# EAGLE design pcb_tcc_v2 (EAGLE 9.6.2)
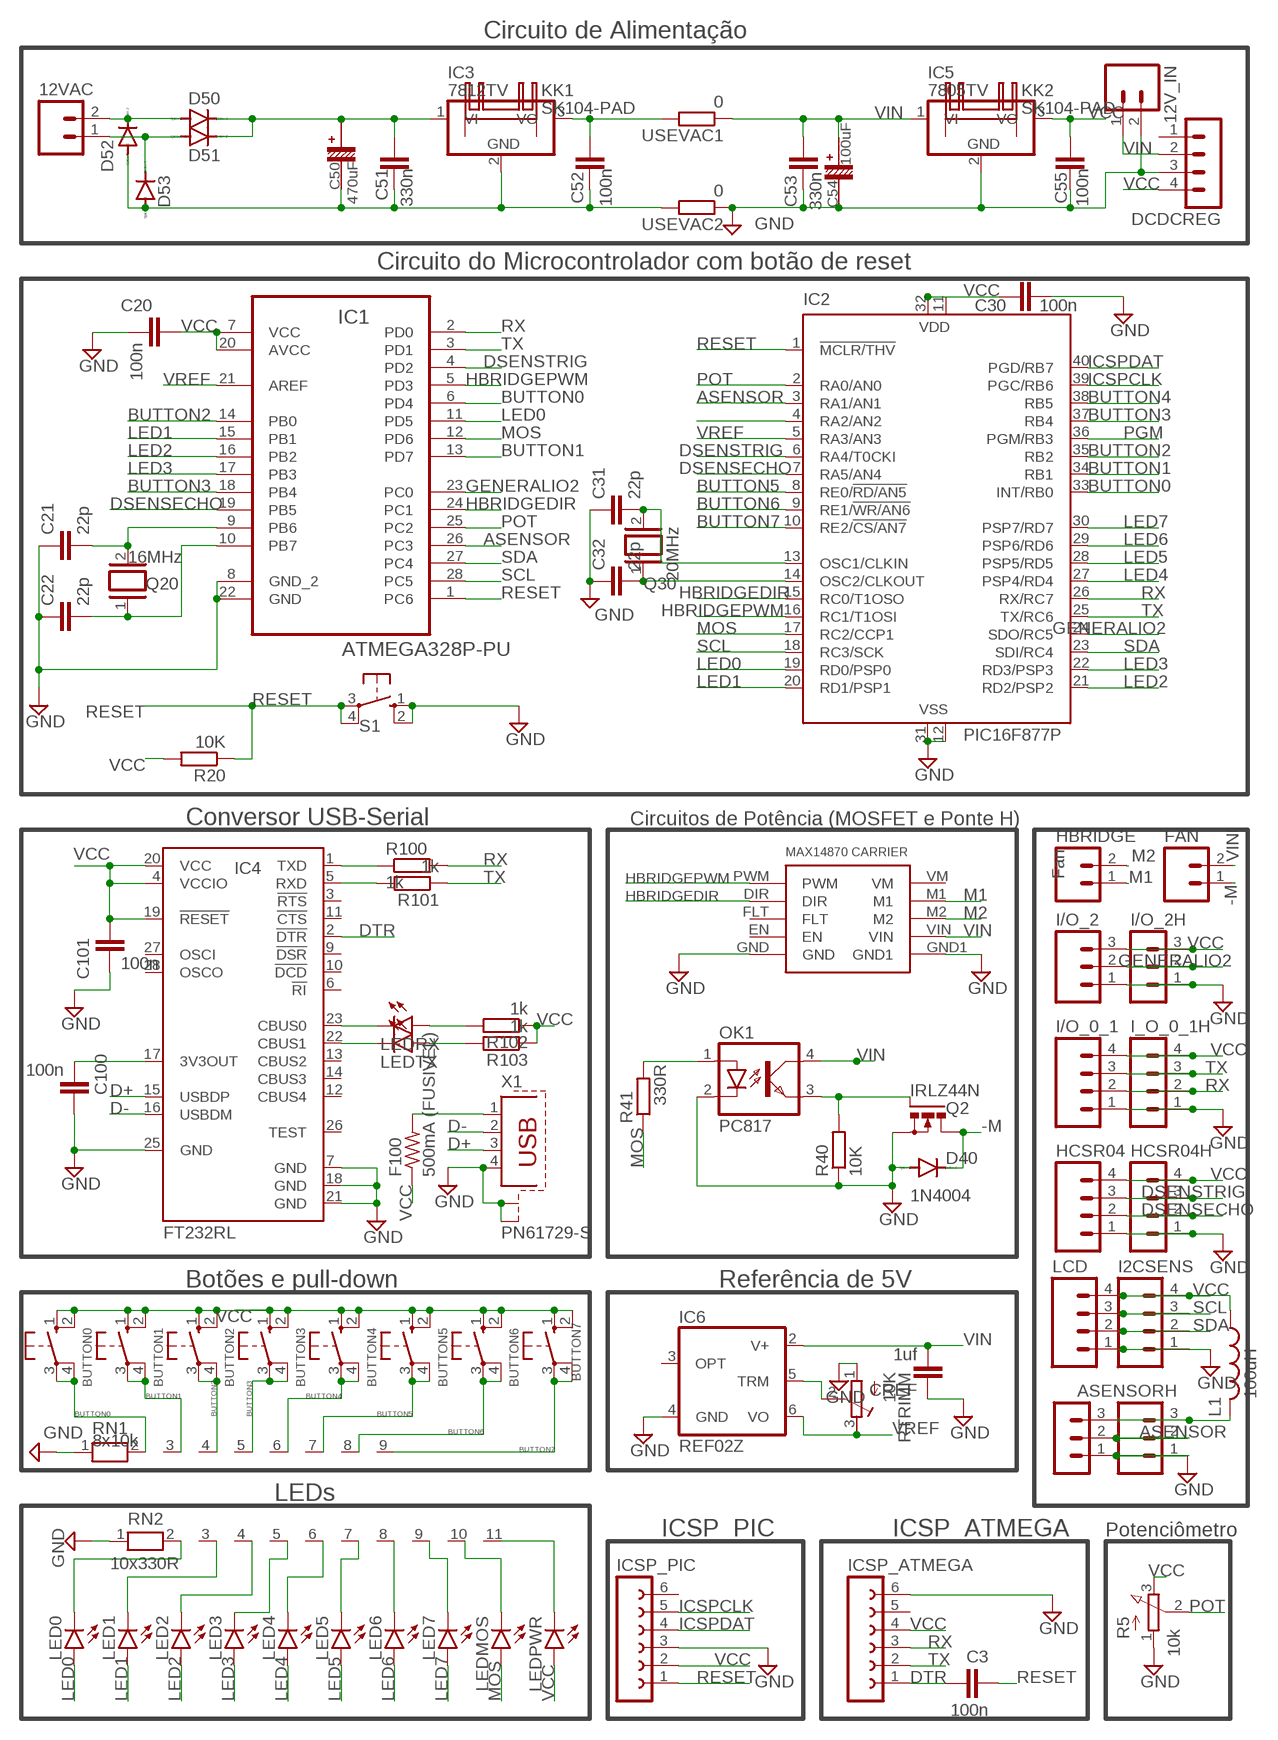
[diagram p0: schematic, sheet 1]

## Parts
12V_IN  M02  [02P]
12VAC  M02  [02P]
ASENSOR  M03  [03P]
ASENSORH  MA03-1  [MA03-1]
BUTTON0  10-XX  [B3F-10XX]
BUTTON1  10-XX  [B3F-10XX]
BUTTON2  10-XX  [B3F-10XX]
BUTTON3  10-XX  [B3F-10XX]
BUTTON4  10-XX  [B3F-10XX]
BUTTON5  10-XX  [B3F-10XX]
BUTTON6  10-XX  [B3F-10XX]
BUTTON7  10-XX  [B3F-10XX]
C3  100n  C5/2.5  [C5B2.5]
C20  100n  C5/2.5  [C5B2.5]
C21  22p  C5/2.5  [C5B2.5]
C22  22p  C5/2.5  [C5B2.5]
C30  100n  C5/2.5  [C5B2.5]
C31  22p  C5/2.5  [C5B2.5]
C32  22p  C5/2.5  [C5B2.5]
C50  470uF  CE-16V-10-5.08  [16V-10-5.08]
C51  330n  C5/2.5  [C5B2.5]
C52  100n  C5/2.5  [C5B2.5]
C53  330n  C5/2.5  [C5B2.5]
C54  100uF  CE-16V-06.3-2.54  [16V-6.3-2.54]
C55  100n  C5/2.5  [C5B2.5]
C100  100n  C5/2.5  [C5B2.5]
C101  100n  C5/2.5  [C5B2.5]
CREF  1uf  C2.5/2  [C2.5-2]
D40  1N4004  [DO41-10]
D50  1N4004  [DO41-10]
D51  1N4004  [DO41-10]
D52  1N4004  [DO41-10]
D53  1N4004  [DO41-10]
DCDCREG  MA04-1  [MA04-1]
F100  500mA (FUSIVEL)  R-US_R1206  [R1206]
FAN  M02  [02P]
HBRIDGE  M02  [02P]
HCSR04  M04  [04P]
HCSR04H  MA04-1  [MA04-1]
I2CSENS  M04  [04P]
I/O_0_1  M04  [04P]
I/O_2  M03  [03P]
I/O_2H  MA03-1  [MA03-1]
I_O_0_1H  MA04-1  [MA04-1]
IC1  ATMEGA328P-PU  [DIP254P762X457-28]
IC2  PIC16F877P  [DIL40]
IC3  7812TV  [TO220V]
IC4  FT232RL  [SSOP28]
IC5  7805TV  [TO220V]
IC6  REF02Z  [DIL08]
ICSP_ATMEGA  FE06-1  [FE06]
ICSP_PIC  FE06-1  [FE06]
KK1  SK104-PAD  [SK104-PAD]
KK2  SK104-PAD  [SK104-PAD]
L1  100uH  L-US0204/7  [0204/7]
LCD  M04  [04P]
LED0  LED3MM  [LED3MM]
LED1  LED3MM  [LED3MM]
LED2  LED3MM  [LED3MM]
LED3  LED3MM  [LED3MM]
LED4  LED3MM  [LED3MM]
LED5  LED3MM  [LED3MM]
LED6  LED3MM  [LED3MM]
LED7  LED3MM  [LED3MM]
LEDMOS  LED3MM  [LED3MM]
LEDPWR  LED3MM  [LED3MM]
LEDRX  LED3MM  [LED3MM]
LEDTX  LED3MM  [LED3MM]
OK1  PC817  [DIL04]
Q2  IRLZ44N  IRF512  [TO220BV]
Q20  16MHz  XTAL/S  [QS]
Q30  20MHz  XTAL/S  [QS]
R5  10k  3RP/1610N  [3RP/1610N]
R20  10K  R-EU_0207/10  [0207/10]
R40  10K  R-EU_0207/10  [0207/10]
R41  330R  R-EU_0207/7  [0207/7]
R100  1k  R-EU_0207/10  [0207/10]
R101  1k  R-EU_0207/10  [0207/10]
R102  1k  R-EU_0207/10  [0207/10]
R103  1k  R-EU_0207/10  [0207/10]
RN1  8x10k  RN08  [RN-9]
RN2  10x330R  RN10  [RN-11]
RTRIMM  10K  R-TRIMM3296W  [RTRIM3296W]
S1  10-XX  [B3F-10XX]
U$1  MAX14870  [POLOLU_CARRIER]
USEVAC1  0  R-EU_0207/10  [0207/10]
USEVAC2  0  R-EU_0207/10  [0207/10]
X1  PN61729-S  [PN61729-S]

## Nets
-M: D40.C FAN.1 Q2.D
ASENSOR: ASENSOR.2 ASENSORH.2 IC1.26(PC3) IC2.3(RA1/AN1)
BUTTON0: BUTTON0.3(P) BUTTON0.4(P1) IC1.6(PD4) IC2.33(INT/RB0) RN1.2
BUTTON1: BUTTON1.3(P) BUTTON1.4(P1) IC1.13(PD7) IC2.34(RB1) RN1.3
BUTTON2: BUTTON2.3(P) BUTTON2.4(P1) IC1.14(PB0) IC2.35(RB2) RN1.4
BUTTON3: BUTTON3.3(P) BUTTON3.4(P1) IC1.18(PB4) IC2.37(RB4) RN1.5
BUTTON4: BUTTON4.3(P) BUTTON4.4(P1) IC2.38(RB5) RN1.6
BUTTON5: BUTTON5.3(P) BUTTON5.4(P1) IC2.8(RE0/!RD/AN5) RN1.7
BUTTON6: BUTTON6.3(P) BUTTON6.4(P1) IC2.9(RE1/!WR/AN6) RN1.8
BUTTON7: BUTTON7.3(P) BUTTON7.4(P1) IC2.10(RE2/!CS/AN7) RN1.9
D+: IC4.15(USBDP) X1.3
D-: IC4.16(USBDM) X1.2
DSENSECHO: HCSR04.2 HCSR04H.2 IC1.19(PB5) IC2.7(RA5/AN4)
DSENSTRIG: HCSR04.3 HCSR04H.3 IC1.4(PD2) IC2.6(RA4/T0CKI)
DTR: C3.1 IC4.2(!DTR) ICSP_ATMEGA.1
GENERALIO2: I/O_2.2 I/O_2H.2 IC1.23(PC0) IC2.24(SDO/RC5)
GND: 12V_IN.2 ASENSOR.1 ASENSORH.1 C20.2 C21.1 C22.1 C30.2 C31.1 C32.1 C53.1 C54.- C55.1 C100.1 C101.2 CREF.1 D40.A DCDCREG.3 HCSR04.1 HCSR04H.1 I2CSENS.1 I/O_0_1.1 I/O_2.1 I/O_2H.1 I_O_0_1H.1 IC1.8(GND_2) IC1.22(GND) IC2.12(VSS) IC2.31(VSS) IC4.7(GND) IC4.18(GND) IC4.21(GND) IC4.25(GND) IC5.2(GND) IC6.4(GND) ICSP_ATMEGA.6 ICSP_PIC.3 LCD.1 OK1.2(C) Q2.S R5.1(A) R40.1 RN1.1 RN2.1 RTRIMM.1(A) S1.1(S) S1.2(S1) U$1.GND U$1.GND1 USEVAC2.1 X1.4 X1.S1 X1.S2
HBRIDGEDIR: IC1.24(PC1) IC2.15(RC0/T1OSO) U$1.DIR
HBRIDGEPWM: IC1.5(PD3) IC2.16(RC1/T1OSI) U$1.PWM
ICSPCLK: IC2.39(PGC/RB6) ICSP_PIC.5
ICSPDAT: IC2.40(PGD/RB7) ICSP_PIC.4
LED0: IC1.11(PD5) IC2.19(RD0/PSP0) LED0.A
LED1: IC1.15(PB1) IC2.20(RD1/PSP1) LED1.A
LED2: IC1.16(PB2) IC2.21(RD2/PSP2) LED2.A
LED3: IC1.17(PB3) IC2.22(RD3/PSP3) LED3.A
LED4: IC2.27(PSP4/RD4) LED4.A
LED5: IC2.28(PSP5/RD5) LED5.A
LED6: IC2.29(PSP6/RD6) LED6.A
LED7: IC2.30(PSP7/RD7) LED7.A
M1: HBRIDGE.1 U$1.M1
M2: HBRIDGE.2 U$1.M2
MOS: IC1.12(PD6) IC2.17(RC2/CCP1) LEDMOS.A R41.1
N$1: C21.2 IC1.9(PB6) Q20.2
N$2: C22.2 IC1.10(PB7) Q20.1
N$3: 12VAC.2 D50.A D52.C
N$4: OK1.3(EMIT) Q2.G R40.2
N$5: 12VAC.1 D51.A D53.C
N$6: ASENSOR.3 ASENSORH.3 L1.2
N$7: C50.- C51.1 C52.1 D52.A D53.A IC3.2(GND) USEVAC2.2
N$8: OK1.1(A) R41.2
N$9: C50.+ C51.2 D50.C D51.C IC3.1(VI)
N$10: LED0.K(C) RN2.2
N$11: C100.2 IC4.17(3V3OUT)
N$12: IC2.4(RA2/AN2)
N$13: IC4.1(TXD) R100.1
N$14: IC4.5(RXD) R101.2
N$15: C52.2 IC3.3(VO) USEVAC1.2
N$16: LED1.K(C) RN2.3
N$17: LED2.K(C) RN2.4
N$18: LED3.K(C) RN2.5
N$19: LED4.K(C) RN2.6
N$20: LED5.K(C) RN2.7
N$21: C31.2 IC2.13(OSC1/CLKIN) Q30.2
N$22: C32.2 IC2.14(OSC2/CLKOUT) Q30.1
N$23: LED6.K(C) RN2.8
N$24: LED7.K(C) RN2.9
N$25: LEDMOS.K(C) RN2.10
N$26: IC6.5(TRM) RTRIMM.2(S)
N$27: LEDPWR.K(C) RN2.11
N$28: F100.2 X1.1
N$29: IC4.23(CBUS0) LEDRX.K(C)
N$30: IC4.22(CBUS1) LEDTX.K(C)
N$31: LEDRX.A R102.2
N$32: LEDTX.A R103.2
PGM: IC2.36(PGM/RB3)
POT: IC1.25(PC2) IC2.2(RA0/AN0) R5.2(S)
RESET: C3.2 IC1.1(PC6) IC2.1(!MCLR/THV) ICSP_PIC.1 R20.1 S1.3(P) S1.4(P1)
RX: I/O_0_1.2 I_O_0_1H.2 IC1.2(PD0) IC2.26(RX/RC7) ICSP_ATMEGA.3 R100.2
SCL: I2CSENS.3 IC1.28(PC5) IC2.18(RC3/SCK) LCD.3
SDA: I2CSENS.2 IC1.27(PC4) IC2.23(SDI/RC4) LCD.2
TX: I/O_0_1.3 I_O_0_1H.3 IC1.3(PD1) IC2.25(TX/RC6) ICSP_ATMEGA.2 R101.1
VCC: BUTTON0.1(S) BUTTON0.2(S1) BUTTON1.1(S) BUTTON1.2(S1) BUTTON2.1(S) BUTTON2.2(S1) BUTTON3.1(S) BUTTON3.2(S1) BUTTON4.1(S) BUTTON4.2(S1) BUTTON5.1(S) BUTTON5.2(S1) BUTTON6.1(S) BUTTON6.2(S1) BUTTON7.1(S) BUTTON7.2(S1) C20.1 C30.1 C55.2 C101.1 DCDCREG.4 F100.1 HCSR04.4 HCSR04H.4 I2CSENS.4 I/O_0_1.4 I/O_2.3 I/O_2H.3 I_O_0_1H.4 IC1.7(VCC) IC1.20(AVCC) IC2.11(VDD) IC2.32(VDD) IC4.4(VCCIO) IC4.19(!RESET) IC4.20(VCC) IC5.3(VO) ICSP_ATMEGA.4 ICSP_PIC.2 L1.1 LCD.4 LEDPWR.A R5.3(E) R20.2 R102.1 R103.1
VIN: 12V_IN.1 C53.2 C54.+ CREF.2 DCDCREG.2 FAN.2 IC5.1(VI) IC6.2(V+) OK1.4(COL) U$1.VIN USEVAC1.1
VREF: IC1.21(AREF) IC2.5(RA3/AN3) IC6.6(VO) RTRIMM.3(E)
Unconnected: DCDCREG.1 IC4.3(!RTS) IC4.6(!RI) IC4.9(!DSR) IC4.10(!DCD) IC4.11(!CTS) IC4.12(CBUS4) IC4.13(CBUS2) IC4.14(CBUS3) IC4.26(TEST) IC4.27(OSCI) IC4.28(OSCO) IC6.3(OPT) ICSP_ATMEGA.5 ICSP_PIC.6 KK1.K1(K) KK1.K2(K) KK2.K1(K) KK2.K2(K) U$1.EN U$1.FLT U$1.VM

## Notes on the sheet
- Circuito de Alimentação
- Circuito do Microcontrolador com botão de reset
- Conversor USB-Serial | Circuitos de Potência (MOSFET e Ponte H)
- Fan
- Botões e pull-down | Referência de 5V
- LEDs
- ICSP_PIC | ICSP_ATMEGA | Potenciômetro

## Library data of the parts
12V_IN 12VAC FAN HBRIDGE = con-amp-quick:M02: AMP QUICK CONNECTOR; OC_FARNELL: unknown; OC_NEWARK: unknown
ASENSOR I/O_2 = con-amp-quick:M03: AMP QUICK CONNECTOR; OC_FARNELL: unknown; OC_NEWARK: unknown
ASENSORH I/O_2H = con-lstb:MA03-1: PIN HEADER; OC_FARNELL: unknown; OC_NEWARK: unknown
BUTTON0 BUTTON1-BUTTON7 S1 = switch-omron:10-XX: OMRON SWITCH; MPN: B3F-1000; OC_FARNELL: 176432; OC_NEWARK: 36M3542
C3 C20-C22 C30-C32 C51-C53 C55 C100 C101 CREF = capacitor-wima:C: CAPACITOR naming: grid - package width
C50 C54 = a_caps:CE-: ELECTROLYTIC CAPACITOR Japanese symbol
D40 D50-D53 = diode:1N4004: DIODE general purpose rectifier, 1 A
DCDCREG HCSR04H I_O_0_1H = con-lstb:MA04-1: PIN HEADER; OC_FARNELL: unknown; OC_NEWARK: unknown
F100 = rcl:R-US_: RESISTOR, American symbol; SPICEPREFIX: R
HCSR04 I2CSENS I/O_0_1 LCD = con-amp-quick:M04: AMP QUICK CONNECTOR; OC_FARNELL: unknown; OC_NEWARK: unknown
IC1 = Atmel_By_element14_Batch_1-00:ATMEGA328P-PU: 8-bit Microcontroller with In-System Programmable Flash; MPN: ATMEGA328P-PU; OC_FARNELL: 1715487; OC_NEWARK: 15R0268; PACKAGE: PDIP-28; SUPPLIER: Atmel
IC2 = microchip:PIC16F87*: MICROCONTROLLER; MF: MICROCHIP; MPN: PIC16F877-04/P; OC_FARNELL: 9761349; OC_NEWARK: 61K3463
IC3 IC5 = linear:78*: Positive VOLTAGE REGULATOR Source: http://cache.national.com/ds/LM/LM78L05.pdf http://www.fairchildsemi.com/ds/LM/LM7805.pdf
IC4 = ftdichip:FT232R: Source: http://www.ftdichip.com/Documents/DataSheets/DS_FT232R_v104.pdf; MPN: FT232RL; OC_FARNELL: 1146032; OC_NEWARK: 91K9918
IC6 = linear:REF02: VOLTAGE REFERENCE
ICSP_ATMEGA ICSP_PIC = con-lsta:FE06-1: FEMALE HEADER; OC_FARNELL: unknown; OC_NEWARK: unknown
KK1 KK2 = heatsink:SK104-PAD: HEATSINK manufacturer Fischer/distributor Buerklin
L1 = rcl:L-US: INDUCTOR, American symbol; SPICEPREFIX: L
LED0 LED1-LED7 LEDMOS LEDPWR LEDRX LEDTX = led:LED: LED OSRAM: - CHIPLED LG R971, LG N971, LY N971, LG Q971, LY Q971, LO R971, LY R971 LH N974, LH R974 LS Q976, LO Q976, LY Q976 LO Q996 - Hyper CHIPLED LW Q18S LB Q993, LB Q99A, LB R99A - SideLED LS A670, LO A670, LY A670, LG A670, LP A670 LB A673, LV A673, LT A673, LW A673 LH A674 LY A675 LS A676, LA A676, LO A676, LY A676, LW A676 LS A679, LY A679, LG A679 - Hyper Micro SIDELED® LS Y876, LA Y876, LO Y876, LY Y876 LT Y87S - SmartLED LW L88C, LW L88S LB L89C, LB L89S, LG L890 LS L89K, LO L89K, LY L89K LS L896, LA L896, LO L896, LY L896 - TOPLED LS T670, LO T670, LY T670, LG T670, LP T670 LSG T670, LSP T670, LSY T670, LOP T670, LYG T670 LG T671, LOG T671, LSG T671 LB T673, LV T673, LT T673, LW T673 LH T674 LS T676, LA T676, LO T676, LY T676, LB T676, LH T676, LSB T676, LW T676 LB T67C, LV T67C, LT T67C, LS T67K, LO T67K, LY T67K, LW E67C LS E67B, LA E67B, LO E67B, LY E67B, LB E67C, LV E67C, LT E67C LW T67C LS T679, LY T679, LG T679 LS T770, LO T770, LY T770, LG T770, LP T770 LB T773, LV T773, LT T773, LW T773 LH T774 LS E675, LA E675, LY E675, LS T675 LS T776, LA T776, LO T776, LY T776, LB T776 LHGB T686 LT T68C, LB T68C - Hyper Mini TOPLED® LB M676 - Mini TOPLED Santana® LG M470 LS M47K, LO M47K, LY M47K Source: http://www.osram.convergy.de LUXEON: - LUMILED® LXK2-PW12-R00, LXK2-PW12-S00, LXK2-PW14-U00, LXK2-PW14-V00 LXK2-PM12-R00, LXK2-PM12-S00, LXK2-PM14-U00 LXK2-PE12-Q00, LXK2-PE12-R00, LXK2-PE12-S00, LXK2-PE14-T00, LXK2-PE14-U00 LXK2-PB12-K00, LXK2-PB12-L00, LXK2-PB12-M00, LXK2-PB14-N00, LXK2-PB14-P00, LXK2-PB14-Q00 LXK2-PR12-L00, LXK2-PR12-M00, LXK2-PR14-Q00, LXK2-PR14-R00 LXK2-PD12-Q00, LXK2-PD12-R00, LXK2-PD12-S00 LXK2-PH12-R00, LXK2-PH12-S00 LXK2-PL12-P00, LXK2-PL12-Q00, LXK2-PL12-R00 Source: www.luxeon.com KINGBRIGHT: KA-3528ASYC Source: www.kingbright.com
OK1 = optocoupler:PC817: SHARP OPTO COUPLER; MPN: PC817X4J000F; OC_FARNELL: 9707727; OC_NEWARK: 97K7059
Q2 = transistor-power:IRF512: N-CHANNEL MOS FET
Q20 Q30 = special:XTAL/S: CRYSTAL
R5 = pot:3RP/1610N: 16mm Potentiometer one level Source: http://www.alphapotentiometers.net/html/16mm_pot_2.html
R20 R40 R41 R100-R103 USEVAC1 USEVAC2 = rcl:R-EU_: RESISTOR, European symbol; SPICEPREFIX: R
RN1 = resistor-net:RN08: RESISTOR NETWORK; OC_FARNELL: unknown; OC_NEWARK: unknown
RN2 = resistor-net:RN10: RESISTOR NETWORK; OC_FARNELL: unknown; OC_NEWARK: unknown
RTRIMM = resistor:R-TRIMM: Trimm resistor
U$1 = luciano:MAX14870
X1 = con-berg:PN61729-S: BERG USB connector; OC_FARNELL: unknown; OC_NEWARK: unknown

## Board
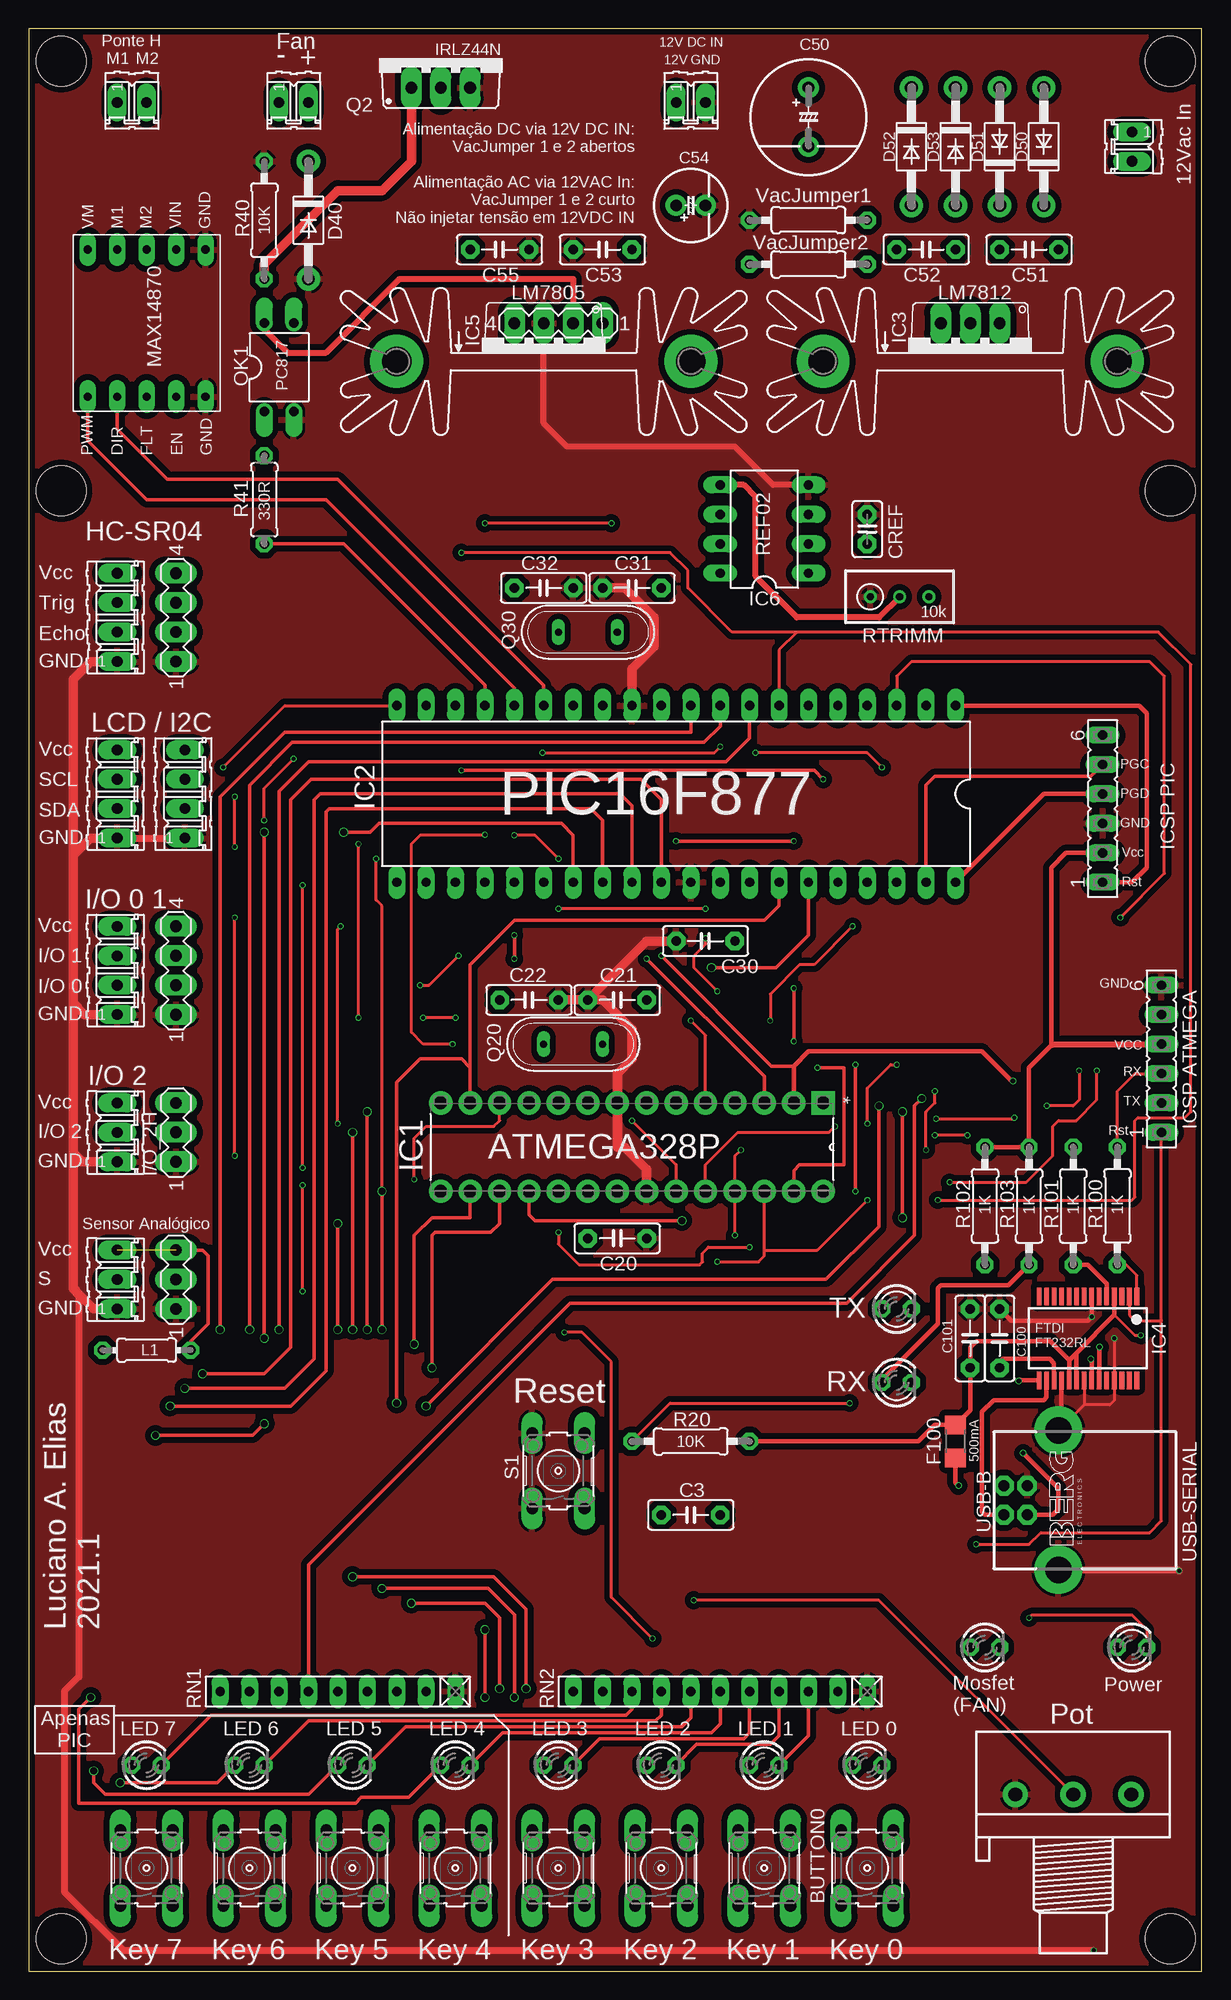
[diagram p1: board, top side]
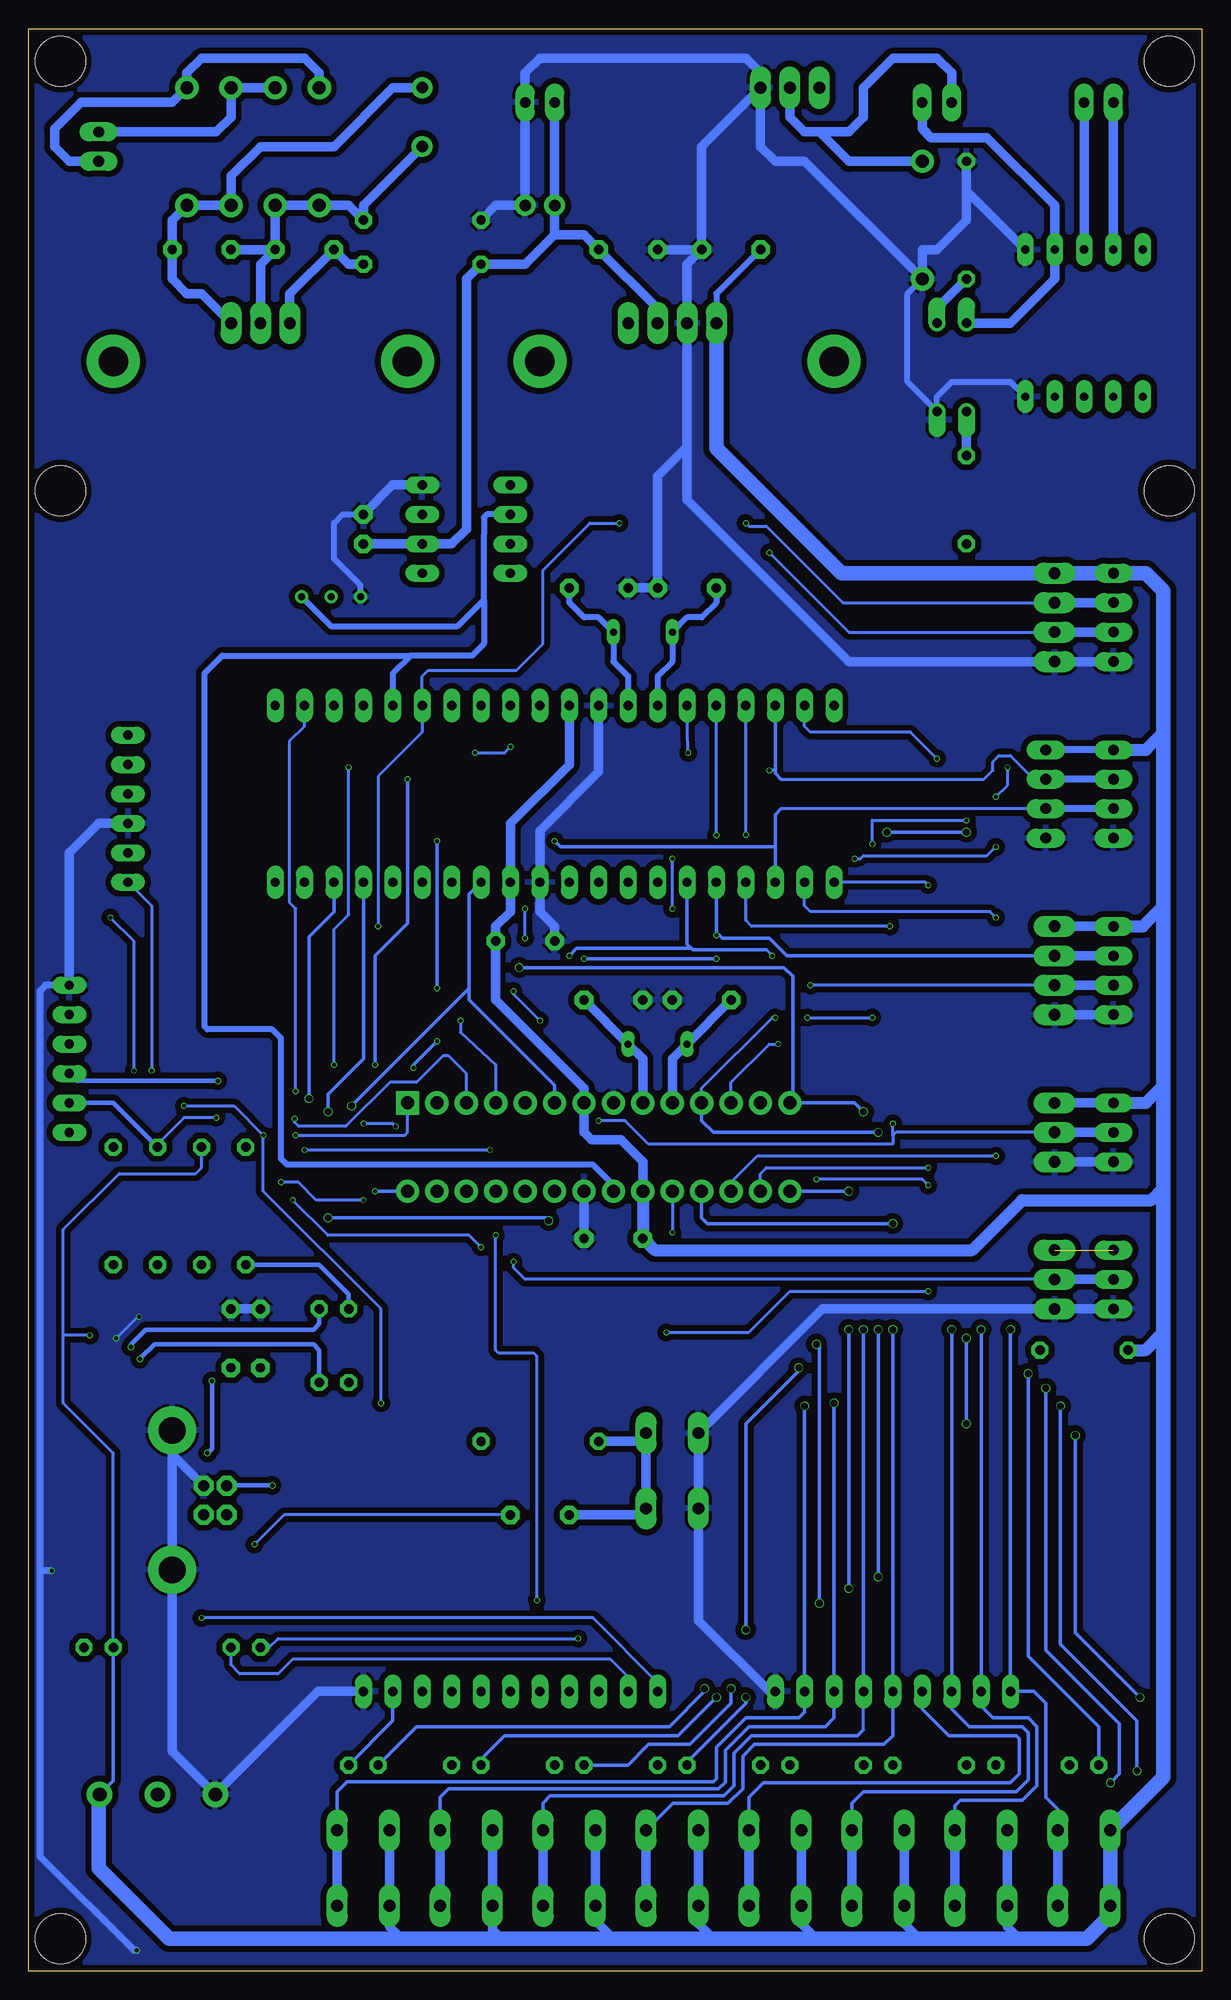
[diagram p2: board, bottom side, seen from below]

Size 101.27 x 167.63 mm. Coordinates in mm from the lower left corner, seen from the top.
Outline: 0,0 101.27,0 101.27,167.63 0,167.63 0,0
Copper layers (1*16): Top 0.035mm / dielectric 1.6mm / Bottom 0.035mm
Design rules "jlcpcb-2layers": minimum track width 5mil, minimum drill 0.3mm, track to track 5mil, track to pad 5mil, pad to pad 5mil, via to via 5mil, smd to smd 5mil, copper to edge 0.2mm, drill to drill 6mil, minimum pad ring 10mil, minimum via ring 3mil, stop-mask expansion 4mil, vias tented up to drill 0mil, thermal gap 10mil
Holes 4.32 mm at 2.79,164.85 98.55,164.85 98.55,2.79 2.79,2.79 2.79,127.76 98.55,127.76

### Footprints (pad centres in the part's own frame; a part is rotated, then mirrored left to right if it is on the bottom)
02P = drill 0.914 long: 1 -1.27,0; 2 1.27,0
03P = drill 0.914 long: 1 -2.54,0; 2 0,0; 3 2.54,0
MA03-1 = drill 1.016 long: 1 -2.54,0; 2 0,0; 3 2.54,0
B3F-10XX = drill 1.016 long: 1 -3.251,2.261; 2 3.251,2.261; 3 -3.251,-2.261; 4 3.251,-2.261
C5B2.5 = drill 0.813 pad 1.6 octagon: 1 -2.54,0; 2 2.54,0
16V-10-5.08 = drill 1: + -2.54,0; - 2.54,0
16V-6.3-2.54 = drill 1: + -1.27,0; - 1.27,0
C2.5-2 = drill 0.813 pad 1.6 octagon: 1 -1.27,0; 2 1.27,0
DO41-10 = drill 1.118: A 5.08,0; C -5.08,0
MA04-1 = drill 1.016 long: 1 -3.81,0; 2 -1.27,0; 3 1.27,0; 4 3.81,0
R1206 = smd 1.6 x 1.803: 1 -1.422,0; 2 1.422,0
04P = drill 0.914 long: 1 -3.81,0; 2 -1.27,0; 3 1.27,0; 4 3.81,0
DIP254P762X457-28 = drill 1.118 square: 1 -7.62,33.02 | drill 1.118: 2 -7.62,30.48; 3 -7.62,27.94; 4 -7.62,25.4; 5 -7.62,22.86; 6 -7.62,20.32; 7 -7.62,17.78; 8 -7.62,15.24; 9 -7.62,12.7; 10 -7.62,10.16; 11 -7.62,7.62; 12 -7.62,5.08; 13 -7.62,2.54; 14 -7.62,0; 15 0,0; 16 0,2.54; 17 0,5.08; 18 0,7.62; 19 0,10.16; 20 0,12.7; 21 0,15.24; 22 0,17.78; 23 0,20.32; 24 0,22.86; 25 0,25.4; 26 0,27.94; 27 0,30.48; 28 0,33.02
DIL40 = drill 0.813 long: 1 -24.13,-7.62; 2 -21.59,-7.62; 3 -19.05,-7.62; 4 -16.51,-7.62; 5 -13.97,-7.62; 6 -11.43,-7.62; 7 -8.89,-7.62; 8 -6.35,-7.62; 9 -3.81,-7.62; 10 -1.27,-7.62; 11 1.27,-7.62; 12 3.81,-7.62; 13 6.35,-7.62; 14 8.89,-7.62; 15 11.43,-7.62; 16 13.97,-7.62; 17 16.51,-7.62; 18 19.05,-7.62; 19 21.59,-7.62; 20 24.13,-7.62; 21 24.13,7.62; 22 21.59,7.62; 23 19.05,7.62; 24 16.51,7.62; 25 13.97,7.62; 26 11.43,7.62; 27 8.89,7.62; 28 6.35,7.62; 29 3.81,7.62; 30 1.27,7.62; 31 -1.27,7.62; 32 -3.81,7.62; 33 -6.35,7.62; 34 -8.89,7.62; 35 -11.43,7.62; 36 -13.97,7.62; 37 -16.51,7.62; 38 -19.05,7.62; 39 -21.59,7.62; 40 -24.13,7.62
TO220V = drill 1.016 long: 1 -2.54,-2.54; 2 0,-2.54; 3 2.54,-2.54
SSOP28 = smd 0.4 x 1.5: 1 -4.225,-3.625; 2 -3.575,-3.625; 3 -2.925,-3.625; 4 -2.275,-3.625; 5 -1.625,-3.625; 6 -0.975,-3.625; 7 -0.325,-3.625; 8 0.325,-3.625; 9 0.975,-3.625; 10 1.625,-3.625; 11 2.275,-3.625; 12 2.925,-3.625; 13 3.575,-3.625; 14 4.225,-3.625; 15 4.225,3.625; 16 3.575,3.625; 17 2.925,3.625; 18 2.275,3.625; 19 1.625,3.625; 20 0.975,3.625; 21 0.325,3.625; 22 -0.325,3.625; 23 -0.975,3.625; 24 -1.625,3.625; 25 -2.275,3.625; 26 -2.925,3.625; 27 -3.575,3.625; 28 -4.225,3.625
DIL08 = drill 0.813 long: 1 -3.81,-3.81; 2 -1.27,-3.81; 3 1.27,-3.81; 4 3.81,-3.81; 5 3.81,3.81; 6 1.27,3.81; 7 -1.27,3.81; 8 -3.81,3.81
FE06 = drill 0.813 long: 1 -6.35,0; 2 -3.81,0; 3 -1.27,0; 4 1.27,0; 5 3.81,0; 6 6.35,0
SK104-PAD = drill 2.54 pad 3.81: K1 -12.7,-0.762; K2 12.7,-0.762
0204/7 = drill 0.813 octagon: 1 -3.81,0; 2 3.81,0
LED3MM = drill 0.813 octagon: A -1.27,0; K 1.27,0
DIL04 = drill 0.813 offset: 1 -1.27,-3.81; 2 1.27,-3.81; 3 1.27,3.81; 4 -1.27,3.81
TO220BV = drill 1.016 long: D 0,-2.54; G -2.54,-2.54; S 2.54,-2.54
QS = drill 0.61 long: 1 -2.54,0; 2 2.54,0
3RP/1610N = drill 1.2 pad 2.184: 1 -5,0; 2 0,0; 3 5,0
0207/10 = drill 0.813 octagon: 1 -5.08,0; 2 5.08,0
0207/7 = drill 0.813 octagon: 1 -3.81,0; 2 3.81,0
RN-9 = drill 0.813 long: 1 -10.16,0; 2 -7.62,0; 3 -5.08,0; 4 -2.54,0; 5 0,0; 6 2.54,0; 7 5.08,0; 8 7.62,0; 9 10.16,0
RN-11 = drill 0.813 long: 1 -12.7,0; 2 -10.16,0; 3 -7.62,0; 4 -5.08,0; 5 -2.54,0; 6 0,0; 7 2.54,0; 8 5.08,0; 9 7.62,0; 10 10.16,0; 11 12.7,0
RTRIM3296W = drill 0.61: 1 0,-2.54; 2 0,0; 3 0,2.54
POLOLU_CARRIER = drill 0.7 pad 1.422 long: DIR -5.08,0; EN -5.08,-5.08; FLT -5.08,-2.54; GND -5.08,-7.62; GND1 7.62,-7.62; M1 7.62,0; M2 7.62,-2.54; PWM -5.08,2.54; VIN 7.62,-5.08; VM 7.62,2.54
PN61729-S = drill 0.95 octagon: 1 1.25,4.71; 2 -1.25,4.71; 3 -1.25,2.71; 4 1.25,2.71 | drill 2.3 pad 2.9: S1 -6.02,0; S2 6.02,0

### Placement (x,y rotation side)
12V_IN  57.15,161.29 0 top
12VAC  95.25,157.48 270 top
ASENSOR  7.62,59.69 90 top
ASENSORH  12.7,59.69 90 top
BUTTON0  72.39,8.89 90 top
BUTTON1  63.5,8.89 90 top
BUTTON2  54.61,8.89 90 top
BUTTON3  45.72,8.89 90 top
BUTTON4  36.83,8.89 90 top
BUTTON5  27.94,8.89 90 top
BUTTON6  19.05,8.89 90 top
BUTTON7  10.16,8.89 90 top
C3  57.15,39.37 180 top
C20  50.8,63.25 0 top
C21  50.8,83.82 0 top
C22  43.18,83.82 180 top
C30  58.42,88.9 180 top
C31  52.07,119.38 0 top
C32  44.45,119.38 180 top
C50  67.31,160.02 270 top
C51  86.36,148.59 0 top
C52  77.47,148.59 180 top
C53  49.53,148.59 0 top
C54  57.15,152.4 0 top
C55  40.64,148.59 180 top
C100  83.82,54.61 270 top
C101  81.28,54.61 90 top
CREF  72.39,124.46 270 top
D40  24.13,151.13 270 top
D50  87.63,157.48 90 top
D51  83.82,157.48 90 top
D52  76.2,157.48 270 top
D53  80.01,157.48 270 top
DCDCREG  45.72,142.24 180 top
F100  80.01,45.72 270 top
FAN  22.86,161.29 0 top
HBRIDGE  8.89,161.29 0 top
HCSR04  7.62,116.84 90 top
HCSR04H  12.7,116.84 90 top
I2CSENS  7.62,101.6 90 top
I/O_0_1  7.62,86.36 90 top
I/O_2  7.62,72.39 90 top
I/O_2H  12.7,72.39 90 top
I_O_0_1H  12.7,86.36 90 top
IC1  35.56,67.31 270 top
IC2  55.88,101.6 180 top
IC3  81.28,139.7 180 top
IC4  91.44,54.61 180 top
IC5  44.45,139.7 180 top
IC6  63.5,124.46 90 top
ICSP_ATMEGA  97.79,78.74 90 top
ICSP_PIC  92.71,100.33 90 top
KK1  81.28,139.7 0 top
KK2  44.45,139.7 0 top
L1  10.16,53.59 0 top
LCD  13.46,101.6 90 top
LED0  72.39,17.78 0 top
LED1  63.5,17.78 0 top
LED2  54.61,17.78 0 top
LED3  45.72,17.78 0 top
LED4  36.83,17.78 0 top
LED5  27.94,17.78 0 top
LED6  19.05,17.78 0 top
LED7  10.16,17.78 0 top
LEDMOS  82.55,27.94 0 top
LEDPWR  95.25,27.94 0 top
LEDRX  74.93,57.15 0 top
LEDTX  74.93,50.8 0 top
OK1  21.59,138.43 0 top
Q2  35.56,165.1 0 top
Q20  46.99,80.01 0 top
Q30  48.26,115.57 0 top
R5  90.17,15.24 0 top
R20  57.15,45.72 0 top
R40  20.32,151.13 270 top
R41  20.32,127 90 top
R100  93.98,66.04 90 top
R101  90.17,66.04 270 top
R102  82.55,66.04 270 top
R103  86.36,66.04 270 top
RN1  26.67,24.13 180 top
RN2  59.69,24.13 180 top
RTRIMM  75.18,118.62 270 top
S1  45.72,43.18 90 top
U$1  7.62,140.97 90 top
USEVAC1  67.31,147.32 0 top
USEVAC2  67.31,151.13 0 top
X1  88.9,40.64 90 top

### Tracks (layer width: path | path; a pad name or v marks a point on that pad's centre or on a via)
-M
  Bottom 0.813: FAN.1 21.59,163.83 22.86,165.1 26.67,165.1 29.21,162.56 29.21,160.02 30.48,158.75 33.02,158.75 | 33.02,158.75 30.48,156.21 D40.C | 33.02,158.75 34.29,158.75 35.56,160.02 Q2.D
ASENSOR  (via drill 0.35)
  Top 0.254: v59.44,61.21 62.99,61.21 63.5,61.72 63.5,62.23 | 63.5,62.23 IC1.26 | 63.5,62.23 68.07,62.23 v72.39,66.55 | v79.5,68.07 86.11,68.07 88.39,70.36 88.39,72.9 88.9,73.41 90.42,73.41 92.2,75.18 v92.2,77.72 | v94.23,90.93 98.04,94.74 98.04,111.76 96.77,113.03 76.2,113.03 74.93,111.76 IC2.3
  Bottom 0.254: ASENSORH.2 58.42,59.69 59.44,60.71 v59.44,61.21 | v72.39,66.55 76.45,66.55 77.98,68.07 v79.5,68.07 | v92.2,77.72 92.2,88.9 v94.23,90.93
  Bottom 0.813: ASENSOR.2 ASENSORH.2
BUTTON0  (via drill 0.6)
  Top 0.305: v34.29,48.77 45.21,59.69 68.83,59.69 73.41,64.26 v73.41,74.68
  Top 0.61: BUTTON0.3 74.65,7.14
  Bottom 0.305: BUTTON0.4 74.65,14.71 74.68,14.73 74.68,15.49 73.81,16.36 42.16,16.36 41.91,16.61 41.91,19.3 39.37,21.84 34.8,21.84 34.29,22.35 RN1.2 v34.29,48.77 | v73.41,74.68 63.25,84.84 | IC2.33 63.25,92.96 63.25,84.84 | IC1.6 55.88,76.45 63.25,83.82 63.25,84.84
  Bottom 0.813: BUTTON0.4 BUTTON0.3
BUTTON1  (via drill 0.6)
  Top 0.305: v31.75,49.02 31.75,76.71 33.78,78.74 37.34,78.74 38.1,77.98 IC1.13 38.1,86.87 41.91,90.68 63.5,90.68 64.77,91.95 IC2.34
  Bottom 0.305: BUTTON1.4 65.76,15.01 65.05,15.72 41.73,15.72 41.15,16.31 41.15,19.05 39.12,21.08 32.51,21.08 31.75,21.84 RN1.3 v31.75,49.02
  Bottom 0.813: BUTTON1.4 BUTTON1.3
BUTTON2  (via drill 0.6)
  Top 0.305: v29.21,55.37 v29.21,74.17 | v58.93,86.61 64.52,86.61 67.31,89.41 IC2.35
  Bottom 0.254: 29.21,20.83 RN1.4
  Bottom 0.305: BUTTON2.4 56.87,14.5 56.26,15.11 41.28,15.11 40.39,16 40.39,18.8 38.86,20.32 29.72,20.32 29.21,20.83 | RN1.4 v29.21,55.37 | v29.21,74.17 29.97,74.93 IC1.14 35.31,75.18 35.31,85.85 36.07,86.61 v58.93,86.61
  Bottom 0.813: BUTTON2.4 BUTTON2.3
BUTTON3  (via drill 0.6)
  Top 0.305: v26.67,55.37 v26.67,64.52 | v75.44,74.17 v75.44,65.02 | v56.39,64.77 43.69,64.77 43.18,65.28 IC1.18
  Bottom 0.305: BUTTON3.4 45.64,14.48 40.89,14.48 39.62,15.75 39.62,18.54 38.61,19.56 27.43,19.56 26.67,20.32 RN1.5 v26.67,55.37 | v26.67,64.52 42.67,64.52 43.18,65.02 IC1.18 | IC2.37 72.39,78.74 75.44,75.69 v75.44,74.17 | v75.44,65.02 56.64,65.02 v56.39,64.77
  Bottom 0.813: BUTTON3.4 BUTTON3.3
BUTTON4  (via drill 0.6)
  Top 0.305: RN1.6 24.13,35.05 46.74,57.66 70.61,57.66 76.45,63.5 76.45,74.68 v77.09,75.31
  Bottom 0.305: BUTTON4.4 39.09,15.01 37.85,16.26 16.51,16.26 15.75,17.02 15.75,20.07 16,20.32 21.84,20.32 24.13,22.61 RN1.6 | v77.09,75.31 77.09,89.28 74.93,91.44 IC2.38
  Bottom 0.813: BUTTON4.4 BUTTON4.3
BUTTON5  (via drill 0.6)
  Top 0.305: v21.59,55.37 21.59,101.85 24.13,104.39 60.2,104.39 62.23,106.43 IC2.8
  Bottom 0.305: BUTTON5.4 30.2,14.5 29.21,15.49 16,15.49 14.99,16.51 14.99,20.57 15.49,21.08 20.07,21.08 21.59,22.61 RN1.7 v21.59,55.37
  Bottom 0.813: BUTTON5.4 BUTTON5.3
BUTTON6  (via drill 0.6)
  Top 0.305: v19.05,55.37 19.05,102.36 22.73,106.05 58.29,106.05 59.69,107.44 IC2.9
  Bottom 0.305: BUTTON6.4 21.31,14.25 20.83,14.73 15.49,14.73 14.22,16 14.22,21.08 14.99,21.84 18.03,21.84 19.05,22.86 RN1.8 v19.05,55.37
  Bottom 0.813: BUTTON6.4 BUTTON6.3
BUTTON7  (via drill 0.6)
  Top 0.305: v16.51,55.37 16.51,101.35 22.1,106.93 57.15,106.93 IC2.10
  Bottom 0.305: BUTTON7.4 12.42,13.95 13.46,14.99 13.46,23.11 14.48,24.13 RN1.9 v16.51,55.37
  Bottom 0.813: BUTTON7.4 BUTTON7.3
D+  (via drill 0.4)
  Top 0.406: IC4.15 85.67,50.98 85.6,51.05 v85.47,50.93 | v85.85,44.7 88.9,41.66 88.9,39.88 88.41,39.39 X1.3
  Bottom 0.406: v85.47,50.93 85.47,45.09 v85.85,44.7
D-
  Top 0.406: IC4.16 87.86,49.51 87.63,49.28 83.31,49.28 82.3,48.26 82.3,39.62 82.53,39.39 X1.2
DSENSECHO  (via drill 0.35)
  Top 0.254: v45.72,63.75 45.72,62.74 47.5,60.96 57.91,60.96 58.17,61.21 58.17,61.98 58.67,62.48 v62.23,62.48 | v78.49,66.55 95.25,66.55 95.5,66.8 95.5,73.41 95.76,73.66 99.82,73.66 100.33,74.17 100.33,112.78 97.54,115.57 66.29,115.57 | 66.29,115.57 64.77,114.05 IC2.7 | 66.29,115.57 60.71,115.57 56.9,119.38 56.9,120.9 55.37,122.43 v37.34,122.43
  Bottom 0.254: IC1.19 v45.72,63.75 | v62.23,62.48 63.25,63.5 75.44,63.5 v78.49,66.55 | v37.34,122.43 30.48,115.57 HCSR04H.2
  Bottom 0.813: HCSR04.2 HCSR04H.2
DSENSTRIG  (via drill 0.35)
  Top 0.254: v71.12,90.17 67.82,86.87 66.55,86.87 64.01,84.33 v64.01,82.04 | v50.29,124.97 v39.37,124.97 | HCSR04H.3 12.19,118.11 11.94,118.36 12.45,118.36 HCSR04H.3
  Bottom 0.254: v71.12,90.17 71.12,103.12 67.31,106.93 IC2.6 67.31,111.76 66.8,112.27 59.18,112.27 56.9,114.55 56.9,120.9 52.83,124.97 v50.29,124.97 | v64.01,82.04 64.01,81.03 60.96,78.23 IC1.4 | v39.37,124.97 39.12,124.71 37.59,124.71 30.99,118.11 HCSR04H.3
  Bottom 0.813: HCSR04.3 HCSR04H.3
DTR  (via drill 0.35)
  Top 0.254: v81.79,36.83 86.36,36.83 87.38,37.85 96.77,37.85 97.79,38.86 97.79,56.13 | 97.79,56.13 ICSP_ATMEGA.1 | IC4.2 95.02,56.62 95.5,56.13 97.79,56.13
  Bottom 0.254: C3.1 79.25,39.37 v81.79,36.83
GENERALIO2  (via drill 0.35)
  Top 0.254: v52.07,73.41 55.88,69.6 IC1.23 | v26.67,73.15 26.67,89.92 v26.92,90.17
  Bottom 0.254: I/O_2H.2 26.42,72.39 26.67,72.14 | 26.67,72.14 26.67,71.37 47.75,71.37 49.78,73.41 v52.07,73.41 | 26.67,72.14 v26.67,73.15 | v26.92,90.17 38.86,90.17 39.37,90.68 IC2.24
  Bottom 0.813: I/O_2.2 I/O_2H.2
GND  (via drill 0.35)
  Top 0.254: IC4.25 | IC4.25 93.73,49.28 93.33,48.88 91.11,48.88 | IC4.21 91.11,48.88 | 91.11,48.88 89.16,46.92 | v93.73,54.61 IC4.25
  Top 0.406: IC4.18 89.16,46.92 X1.S2 | IC4.7 v91.77,56.46 91.44,56.13 84.84,56.13 C100.1
  Top 0.508: IC6.4 64.26,128.27 60.96,131.57 46.48,131.57 44.45,133.6 DCDCREG.3
  Top 0.61: X1.S1 99.24,34.62 v99.31,34.54 | 4.32,58.42 4.32,25.4 3.05,24.13 3.05,6.86 8.13,1.78 v91.95,1.78 | I2CSENS.1 LCD.1
  Top 0.813: IC1.22 53.34,69.22 51.44,71.12 50.8,71.12 IC1.8 50.8,77.47 52.07,78.74 52.07,81.28 49.53,83.82 C21.1 | C22.1 C21.1 | C21.1 53.34,88.9 C30.2 | IC2.12 52.07,112.39 53.98,114.3 53.98,116.84 51.44,119.38 C31.1 | ASENSOR.1 5.59,57.15 4.32,58.42 3.81,58.93 3.81,70.61 | HCSR04.1 5.33,113.03 3.81,111.51 3.81,96.27 | 3.81,70.61 3.81,83.57 | 3.81,83.57 3.81,96.27 | I2CSENS.1 5.33,97.79 3.81,96.27 | I/O_0_1.1 4.83,82.55 3.81,83.57 | I/O_2.1 4.57,69.85 3.81,70.61
  Bottom 0.254: v91.77,56.46 91.88,56.46 v93.73,54.61
  Bottom 0.508: D40.A 25.4,144.78 25.4,137.16 OK1.2 22.86,135.89 21.59,137.16 16.51,137.16 U$1.GND | RTRIMM.1 72.64,119.63 74.93,121.92 74.93,124.97 74.17,125.73 CREF.1
  Bottom 0.61: ICSP_ATMEGA.6 99.82,85.09 100.33,84.58 100.33,34.8 | v91.95,1.78 92.2,1.78 100.33,9.91 100.33,34.8 | v99.31,34.54 100.08,34.54 100.33,34.8
  Bottom 0.813: USEVAC2.1 60.96,152.4 C54.- 12V_IN.2 58.42,163.83 57.15,165.1 39.37,165.1 38.1,163.83 Q2.S | Q2.S 43.18,157.48 C55.1 | C55.1 C53.1 | C55.1 44.45,147.32 DCDCREG.3 44.45,131.57 | U$1.GND1 20.32,153.67 R40.1 20.32,151.13 22.86,148.59 24.13,148.59 D40.A 34.29,156.21 36.83,156.21 38.1,157.48 Q2.S | CREF.1 69.85,128.27 IC6.4 | HCSR04.1 HCSR04H.1 30.48,113.03 44.45,127 44.45,131.57 | I/O_0_1.1 I_O_0_1H.1 | I/O_2H.1 I/O_2.1 | ASENSOR.1 ASENSORH.1 32.74,57.15 S1.2 S1.1 43.46,30.25 37.34,24.13 RN1.1 | C20.2 IC1.22 | C30.2 55.88,90.17 57.15,91.44 IC2.31 57.15,98.42 52.07,103.5 IC2.12 | RN2.1 76.28,24.13 R5.1 88.9,18.97 X1.S1 88.9,46.35 89.53,46.99 89.23,46.99 X1.S2 88.9,44.6 X1.4 | C100.1 C101.2 | ICSP_ATMEGA.6 97.79,96.52 95.25,99.06 ICSP_PIC.3 | C31.1 C32.1 46.99,129.03 44.45,131.57
  pour Bottom (isolate 0.508): 0.25,167.39 101.09,167.39 101.09,0.25 0.25,0.25
  pour Top (isolate 0.508): 0.25,167.39 101.09,167.39 101.09,0.25 0.25,0.25
HBRIDGEDIR  (via drill 0.35)
  Top 0.254: IC1.24 58.42,69.6 61.21,72.39 69.09,72.39 v69.6,72.9 | v72.39,73.15 72.39,76.2 74.42,78.23 v74.93,78.23 | v73.66,103.89 72.39,105.16 v62.74,105.16 | v44.35,105.16 44.45,105.13 59.16,105.13 v59.69,105.66
  Top 0.305: IC2.15 44.45,111 26.67,128.78 11.94,128.78 7.62,133.1 U$1.DIR
  Bottom 0.254: v69.6,72.9 69.85,73.15 v72.39,73.15 | v74.93,78.23 74.93,89.92 73.66,91.19 v73.66,103.89 | v62.74,105.16 60.2,105.16 v59.69,105.66 | v44.35,105.16 IC2.15
HBRIDGEPWM  (via drill 0.35)
  Top 0.254: IC1.5 58.42,80.77 v57.15,82.04 | v59.44,84.58 57.4,86.61 57.4,87.63 58.42,88.65 v58.42,89.15 | v58.42,91.69 v45.72,91.69 | v45.72,96.01 43.69,98.04 v41.91,98.04
  Top 0.305: IC2.16 41.91,110.74 25.65,127 10.16,127 5.08,132.08 U$1.PWM
  Bottom 0.254: v57.15,82.04 59.44,84.33 v59.44,84.58 | v58.42,89.15 v58.42,91.69 | v45.72,91.69 v45.72,96.01 | v41.91,98.04 IC2.16
ICSPCLK
  Top 0.305: ICSP_PIC.5 91.69,103.12 78.23,103.12 77.47,102.36 IC2.39
ICSPDAT
  Top 0.406: ICSP_PIC.4 87.63,101.6 IC2.40
LED0  (via drill 0.35, 0.6)
  Top 0.254: v36.83,82.3 v34.04,82.3 | v28.45,82.3 v28.45,97.28 | v20.32,99.31 20.32,102.11 v22.86,104.65
  Top 0.305: v42.93,24.38 42.93,31.24 40.13,34.04 v27.94,34.04 | v27.94,55.37 v27.94,72.39
  Bottom 0.254: IC1.11 43.18,76.2 37.08,82.3 v36.83,82.3 | v34.04,82.3 v28.45,82.3 | v28.45,97.28 28.45,99.34 20.32,99.34 v20.32,99.31 | v22.86,104.65 25.15,106.93 33.78,106.93 34.29,107.44 IC2.19
  Bottom 0.305: LED0.A 67.82,21.08 45.97,21.08 42.93,24.13 v42.93,24.38 | v27.94,34.04 v27.94,55.37 | v27.94,72.39 42.16,72.39 43.18,73.41 IC1.11
LED1  (via drill 0.35, 0.6)
  Top 0.254: v30.48,67.31 30.48,91.95 29.97,92.46 v29.97,96.01 | v17.78,97.03 v17.78,101.35 | v16.76,103.89 22.1,109.22 IC2.20
  Top 0.305: v30.48,67.31 v30.48,55.37 | v30.48,33.02 39.62,33.02 41.91,30.73 v41.91,23.62
  Bottom 0.254: v29.97,96.01 29.46,96.01 29.21,96.27 18.54,96.27 v17.78,97.03 | v17.78,101.35 16.76,102.36 v16.76,103.89
  Bottom 0.305: IC1.15 v30.48,67.31 | v30.48,55.37 v30.48,33.02 | v41.91,23.62 45.21,20.32 60.2,20.32 62.23,18.29 LED1.A
LED2  (via drill 0.35, 0.6)
  Top 0.254: v23.62,69.34 v23.62,93.73
  Top 0.305: v40.64,24.38 40.64,30.48 39.37,31.75 v33.02,31.75 | v33.27,54.1 33.27,63.5 34.8,65.02 38.1,65.02 IC1.16
  Bottom 0.254: IC1.16 38.1,68.83 37.59,69.34 v23.62,69.34 | v23.62,93.73 23.88,93.98 IC2.21
  Bottom 0.305: LED2.A 49.53,17.78 47.75,19.56 44.2,19.56 40.64,23.11 v40.64,24.38 | v33.02,31.75 33.02,53.85 v33.27,54.1
LED3  (via drill 0.35, 0.6)
  Top 0.254: v17.78,70.36 v17.78,90.93
  Top 0.305: v39.37,23.62 v39.37,29.46 | v34.8,52.07 34.8,63.5 35.05,63.75 39.88,63.75 40.64,64.52 IC1.17
  Bottom 0.254: IC1.17 40.64,68.07 38.35,70.36 v17.78,70.36 | v17.78,90.93 18.29,91.44 33.78,91.44 34.29,91.95 IC2.22
  Bottom 0.305: LED3.A 44.45,18.03 39.37,23.11 v39.37,23.62 | v39.37,29.46 39.37,47.24 34.8,51.82 v34.8,52.07
LED4  (via drill 0.6)
  Top 0.305: LED4.A 32.77,14.99 28.7,14.99 28.19,14.48 4.32,14.48 4.32,22.61 v5.33,23.62 | v10.92,46.23 19.3,46.23 v20.32,47.24 | v20.32,54.61 v20.32,98.3 | v27.18,98.3 29.46,98.3 30.23,99.06 45.97,99.06 46.99,98.04 IC2.27
  Bottom 0.305: v5.33,23.62 10.92,29.21 v10.92,46.23 | v20.32,47.24 v20.32,54.61 | v20.32,98.3 v27.18,98.3
LED5  (via drill 0.6)
  Top 0.305: LED5.A 24.13,15.24 6.6,15.24 5.59,16.26 v5.59,17.27 | v12.19,48.77 22.61,48.77 25.65,51.82 25.65,100.08 25.91,100.33 48.51,100.33 49.53,99.31 IC2.28
  Bottom 0.305: v5.59,17.27 5.59,21.59 12.19,28.19 v12.19,48.77
LED6  (via drill 0.6)
  Top 0.305: LED6.A 16.26,16.26 v7.87,16.26 | v13.46,50.29 22.1,50.29 24.64,52.83 24.64,101.09 25.15,101.6 51.05,101.6 52.07,100.58 IC2.29
  Bottom 0.305: v7.87,16.26 7.11,17.02 7.11,21.34 13.46,27.69 v13.46,50.29
LED7  (via drill 0.6)
  Top 0.305: v14.99,51.56 20.32,51.56 22.61,53.85 22.61,101.09 24.38,102.87 52.83,102.87 54.61,101.09 IC2.30
  Bottom 0.305: LED7.A 8.89,21.08 14.99,27.18 v14.99,51.56
M1
  Bottom 0.813: HBRIDGE.1 U$1.M1
M2
  Bottom 0.813: HBRIDGE.2 U$1.M2
MOS  (via drill 0.35)
  Top 0.254: v53.85,28.7 50.29,32.26 50.29,52.58 47.75,55.12 v46.23,55.12 | v23.62,58.67 v23.62,67.82 | v33.27,68.33 33.27,71.88 34.29,72.9 40.13,72.9 40.64,73.41 IC1.12 | v36.58,80.01 34.04,80.01 33.02,81.03 33.02,97.28 33.8,98.07 v39.37,98.07
  Top 0.305: IC2.17 39.37,111 27.18,123.19 R41.1
  Bottom 0.254: LEDMOS.A 80.52,27.94 79.76,28.7 v53.85,28.7 | v46.23,55.12 39.12,55.12 35.56,58.67 v23.62,58.67 | v23.62,67.82 24.13,68.33 v33.27,68.33 | IC1.12 40.64,76.71 37.34,80.01 v36.58,80.01 | v39.37,98.07 IC2.17
N$1
  Bottom 0.813: IC1.9 48.26,78.74 Q20.2 C21.2
N$2
  Bottom 0.813: IC1.10 45.72,78.74 Q20.1 C22.2
N$3
  Bottom 0.813: D52.C 76.2,163.83 77.47,165.1 86.36,165.1 87.63,163.83 D50.A 88.9,161.29 96.77,161.29 99.06,159 99.06,157.48 97.79,156.21 12VAC.2
N$4
  Top 0.813: R40.2 20.32,147.32 26.67,153.67 30.48,153.67 33.02,156.21 Q2.G
  Bottom 0.813: R40.2 22.86,143.51 OK1.3
N$5
  Bottom 0.813: 12VAC.1 85.09,158.75 83.82,160.02 D51.A D53.C
N$6  (1 unrouted)
  Top 0.305: L1.2 13.97,54.36 15.49,55.88 15.49,61.72 14.99,62.23 ASENSORH.3
N$7
  Bottom 0.813: C52.1 D53.A D52.A 73.66,152.4 USEVAC2.2 72.39,152.4 C50.- | C52.1 C51.1 | IC3.2 81.28,147.32 C52.1
N$8
  Bottom 0.813: OK1.1 R41.2
N$9
  Bottom 0.813: IC3.1 86.36,144.78 87.63,144.78 88.9,146.05 C51.2 88.9,151.13 D50.C D51.C 83.82,154.94 81.28,157.48 74.93,157.48 69.85,162.56 C50.+
N$10
  Bottom 0.305: LED0.K 69.85,21.59 RN2.2
N$11
  Top 0.406: IC4.17 88.52,52.45 88.14,52.83 84.07,52.83 83.82,52.58 C100.2
N$13
  Top 0.254: 95.66,58.84 IC4.1 95.66,60.04 94.74,60.96 R100.1
  Bottom 0.254: 94.23,61.21 R100.1
N$14
  Top 0.406: IC4.5 93.06,59.34 91.44,60.96 R101.2
N$15
  Bottom 0.813: IC3.3 78.74,144.78 C52.2 73.66,147.32 USEVAC1.2
N$16
  Top 0.305: LED1.K 67.31,20.32 RN2.3
N$17
  Top 0.305: LED2.K 57.66,19.56 64.01,19.56 64.77,20.32 RN2.4
N$18
  Top 0.305: LED3.K 49.28,20.07 61.72,20.07 62.23,20.57 RN2.5
N$19
  Top 0.305: LED4.K 40.89,20.57 58.93,20.57 59.69,21.34 RN2.6
N$20
  Top 0.305: LED5.K 32.51,21.08 56.39,21.08 57.15,21.84 RN2.7
N$21
  Bottom 0.508: C31.2 54.61,118.11 53.34,116.84 52.07,116.84 Q30.2 50.8,113.03 49.53,111.76 IC2.13
N$22
  Bottom 0.508: IC2.14 46.99,111.76 45.72,113.03 Q30.1 44.45,116.84 43.18,116.84 41.91,118.11 C32.2
N$23
  Top 0.305: LED6.K 24.13,21.59 54.1,21.59 54.61,22.1 RN2.8
N$24
  Top 0.305: LED7.K 15.75,22.1 51.56,22.1 52.07,22.61 RN2.9
N$25
  Bottom 0.254: RN2.10 49.53,25.4 51.05,26.92 78.49,26.92 79.76,25.65 83.06,25.65 83.82,26.42 LEDMOS.K
N$26
  Top 0.508: RTRIMM.2 73.41,116.84 66.29,116.84 62.74,120.4 62.74,127.25 61.72,128.27 IC6.5
N$27  (via drill 0.35)
  Top 0.254: v86.36,30.48 86.61,30.73 95.25,30.73 96.52,29.46 LEDPWR.K
  Bottom 0.254: RN2.11 46.99,24.89 52.58,30.48 v86.36,30.48
N$28  (via drill 0.4)
  Top 0.406: F100.2 80.01,42.16 v80.26,41.91
  Bottom 0.406: v80.26,41.91 84.17,41.91 X1.1
N$29  (via drill 0.4)
  Top 0.406: IC4.23 92.41,53.81 v92.46,53.85
  Bottom 0.406: v92.46,53.85 92.46,54.1 91.19,55.37 76.71,55.37 76.2,55.88 LEDRX.K
N$30  (via drill 0.4)
  Top 0.406: IC4.22 91.77,52.76 v91.69,52.83
  Bottom 0.406: v91.69,52.83 90.42,54.1 76.71,54.1 76.2,53.59 LEDTX.K
N$31
  Bottom 0.406: LEDRX.A 73.66,58.42 76.2,60.96 R102.2
N$32
  Top 0.406: LEDTX.A 73.66,51.05 78.49,55.88 78.49,58.93 78.74,59.18 84.58,59.18 R103.2
POT  (via drill 0.35)
  Top 0.254: R5.2 73.41,32 v57.4,32 | v60.96,63.5 IC1.25 60.96,70.36 v61.47,70.87 | v77.47,70.87 77.47,74.17 78.23,74.93 v78.23,75.95
  Bottom 0.254: v57.4,32 57.4,53.09 57.66,53.34 60.71,53.34 60.96,53.59 v60.96,63.5 | v61.47,70.87 v77.47,70.87 | v78.23,75.95 78.23,91.69 78.74,92.2 78.74,106.17 77.47,107.44 IC2.2
RESET  (via drill 0.35)
  Top 0.254: v90.68,77.72 90.68,75.18 90.17,74.68 v87.88,74.68 | v81.03,72.14 v78.23,72.14 | R20.1 55.37,49.02 v70.87,49.02
  Top 0.406: ICSP_PIC.1 95.25,93.98 96.52,95.25 96.52,108.58 95.88,109.22 IC2.1
  Bottom 0.254: ICSP_PIC.1 90.68,91.95 v90.68,77.72 | v87.88,74.68 83.57,74.68 v81.03,72.14 81.03,67.31 70.87,57.15 v70.87,49.02 | v78.23,72.14 68.83,72.14 68.58,72.39 IC1.1
  Bottom 0.813: R20.1 48.69,45.72 S1.4 S1.3 48.54,39.37 C3.2
RX  (via drill 0.35, 0.4)
  Top 0.254: v33.78,85.09 34.54,85.09 v37.08,87.63 | R100.2 93.98,75.95 95.5,77.47 ICSP_ATMEGA.3
  Top 0.305: v54.61,87.63 64.14,78.11 66.04,78.11
  Top 0.406: v84.96,76.83 84.84,76.83 82.3,79.38 67.31,79.38 66.04,78.11 IC1.2
  Bottom 0.254: I_O_0_1H.2 v33.78,85.09 | v37.08,87.63 37.59,88.14
  Bottom 0.305: 37.59,88.14 43.94,88.14 44.07,88.27 | 44.07,88.27 44.45,88.65 IC2.26 | 44.07,88.27 53.98,88.27 v54.61,87.63
  Bottom 0.406: ICSP_ATMEGA.3 97.16,76.83 v84.96,76.83
  Bottom 0.813: I/O_0_1.2 I_O_0_1H.2
SCL  (via drill 0.35)
  Top 0.305: v71.37,67.31 v71.37,78.23 | v68.58,102.87 67.82,103.63 v37.34,103.63
  Bottom 0.254: 36.32,102.87 18.8,102.87 18.03,103.63 18.03,104.39 17.53,104.9 16.51,104.9 14.48,102.87 LCD.3
  Bottom 0.305: 36.83,103.63 36.83,103.38 36.32,102.87 | 36.83,103.63 IC2.18 | IC1.28 v71.37,67.31 | v71.37,78.23 71.37,87.63 68.58,90.42 v68.58,102.87 | v37.34,103.63 36.83,103.63
  Bottom 0.61: I2CSENS.3 LCD.3
SDA  (via drill 0.35)
  Top 0.305: IC1.27 66.04,69.09 66.55,69.6 70.36,69.6 70.36,77.98 v68.07,77.98 | v66.04,84.84 v66.04,80.26 | v66.04,97.54 v55.88,97.54
  Bottom 0.254: LCD.2 36.32,100.33
  Bottom 0.305: 36.32,100.33 36.83,99.82 36.83,97.03 | 36.83,97.03 IC2.23 | v68.07,77.98 68.07,78.23 v66.04,80.26 | v66.04,97.54 v66.04,84.84 | v55.88,97.54 55.37,97.03 36.83,97.03
  Bottom 0.61: I2CSENS.2 LCD.2
TX  (via drill 0.35)
  Top 0.254: v78.33,73.56 84.99,73.56 v85.09,73.66
  Top 0.305: IC1.3 63.5,77.22 v53.34,87.38 | v41.91,87.38 v41.91,89.41
  Bottom 0.254: IC1.3 63.5,77.47 65.02,78.99 65.53,78.99 67.82,76.71 70.1,76.71 73.91,72.9 77.98,72.9 78.33,73.25 v78.33,73.56 | v85.09,73.66 87.88,73.66 90.3,71.25
  Bottom 0.305: I_O_0_1H.3 35.81,87.63 37.34,89.15 41.4,89.15 41.66,89.41 v41.91,89.41 IC2.25 | v53.34,87.38 v41.91,87.38
  Bottom 0.406: R101.1 90.3,71.25 93.98,74.93 ICSP_ATMEGA.2
  Bottom 0.813: I/O_0_1.3 I_O_0_1H.3
VCC  (via drill 0.35)
  Top 0.254: 93.71,56.64 95.49,54.86 v96.01,54.86
  Top 0.406: ICSP_PIC.2 89.53,96.52 88.27,95.25 88.27,80.01 88.33,79.95 86.36,77.98 R103.1 R102.1 | 93.98,80.01 ICSP_ATMEGA.4 | IC4.4 93.71,56.64 93.71,56.63 90.42,53.34 | 90.42,53.34 90.42,51.03 IC4.20 | IC4.19 89.81,52.73 | 89.81,52.73 90.42,53.34 | 89.81,52.73 88.19,54.36 81.79,54.36 81.28,53.85 C101.1 81.28,48.41 F100.1 78.23,47.14 76.81,45.72 R20.2
  Top 0.508: 88.33,79.95 88.39,80.01 ICSP_ATMEGA.4
  Bottom 0.254: LEDPWR.A 93.98,44.7 98.3,49.02 98.3,54.86 | 98.3,54.86 98.3,64.01 93.47,68.83 86.87,68.83 86.36,69.34 R103.1 | v96.01,54.86 98.3,54.86
  Bottom 0.305: LEDPWR.A 93.98,16.43 95.25,15.16
  Bottom 0.508: C55.2 41.91,144.78 DCDCREG.4
  Bottom 0.61: I2CSENS.4 LCD.4
  Bottom 0.813: I/O_0_1.4 I_O_0_1H.4 | I/O_2H.3 I/O_2.3 6.35,74.93 | IC1.20 48.26,69.85 50.17,71.75 52.71,71.75 53.34,72.39 IC1.7 53.34,76.2 60.96,83.82 C30.1 60.96,90.17 59.69,91.44 IC2.32 59.69,99.06 54.61,104.14 IC2.11 | 5.71,105.41 I2CSENS.4 | BUTTON6.2 BUTTON6.1 16.79,3.83 15.75,2.79 | BUTTON5.2 BUTTON5.1 25.68,4.09 24.38,2.79 | BUTTON4.2 BUTTON4.1 34.57,4.09 33.27,2.79 | BUTTON3.2 BUTTON3.1 43.46,4.09 42.16,2.79 | BUTTON2.2 BUTTON2.1 52.35,4.34 50.8,2.79 | BUTTON0.2 BUTTON0.1 70.13,3.83 69.09,2.79 | BUTTON1.2 BUTTON1.1 61.24,3.58 60.45,2.79 | 9.91,2.79 15.75,2.79 | 15.75,2.79 24.38,2.79 | 24.38,2.79 33.27,2.79 | 33.27,2.79 42.16,2.79 | 42.16,2.79 50.8,2.79 | 50.8,2.79 60.45,2.79 | 60.45,2.79 69.09,2.79 | 69.09,2.79 88.9,2.79 89.15,2.79 | 95.25,15.16 R5.3
  Bottom 1.016: IC1.20 C20.1 47.24,62.23 19.81,62.23 15.49,66.55 4.32,66.55 3.3,67.56 | I/O_2.3 4.83,74.93 3.3,76.45 | I/O_0_1.4 5.08,90.17 3.3,91.95 | I2CSENS.4 4.83,105.41 3.3,106.93 | L1.1 4.83,53.59 3.3,55.12
  Bottom 1.27: DCDCREG.4 41.91,131.44 31.11,120.65 HCSR04H.4 HCSR04.4 4.83,120.65 3.3,119.13 3.3,106.93 3.3,91.95 3.3,76.45 3.3,67.56 3.3,55.12 3.3,16.74 BUTTON7.2 BUTTON7.1 7.9,4.8 9.91,2.79 88.9,2.79 | 89.15,2.79 95.25,8.89 95.25,15.16
VIN
  Top 0.508: OK1.4 20.32,141.73 22.35,139.7 25.65,139.7 32,146.05 46.99,146.05 DCDCREG.2
  Bottom 0.813: 12V_IN.1 C54.+ 55.88,149.86 | 55.88,149.86 58.42,147.32 USEVAC1.1 63.5,146.05 63.5,124.46 64.77,123.19 IC6.2 CREF.2 | 55.88,149.86 53.34,149.86 C53.2 46.99,143.51 DCDCREG.2 | OK1.4 16.51,142.24 12.7,146.05 U$1.VIN 12.7,152.4 18.54,158.24 23.37,158.24 24.13,159 FAN.2
VREF
  Bottom 0.508: IC6.6 61.72,125.73 61.98,125.48 61.98,123.95 61.98,118.36 | 61.98,118.36 61.98,114.55 62.99,113.54 68.33,113.54 | 68.33,113.54 69.85,112.01 IC2.5 | IC1.21 50.8,67.82 52.58,69.6 78.99,69.6 79.5,70.1 79.5,80.52 80.26,81.28 85.85,81.28 86.11,81.53 86.11,112.01 84.58,113.54 68.33,113.54 | RTRIMM.3 75.18,116.08 64.26,116.08 61.98,118.36

### Text on the board
tNames: Ponte H | 12V DC IN | M1 | M2 | Fan | - | IRLZ44N | 12V | GND | + | Alimentação DC via 12V DC IN: / VacJumper 1 e 2 abertos / / Alimentação AC via 12VAC In: / VacJumper 1 e 2 curto / Não injetar tensão em 12VDC IN | 12Vac In | VacJumper1 | VM | M1 | M2 | VIN | GND | 10K | VacJumper2 | LM7805 | LM7812 | PC817 | PWM | DIR | FLT | EN | GND | 330R | HC-SR04 | REF02 | Vcc | Trig | 10k | Echo | GND | LCD / I2C | Vcc | PGC | SCL | PGD | SDA | PIC16F877 | GND | GND | ICSP PIC | Vcc | Rst | I/O 0 1 | Vcc | I/O 1 | GND | I/O 0 | GND | VCC | RX | I/O 2 | TX | Vcc | ICSP ATMEGA | I/O 2 | Rst | ATMEGA328P | GND | 1K | 1K | 1K | 1K | Sensor Analógico | Vcc | S | GND | TX | FTDI / FT232RL | RX | Reset | 10K | 500mA | USB-B | USB-SERIAL | Luciano A. Elias / 2021.1 | Power | Mosfet / (FAN) | Pot | LED 7 | LED 6 | LED 5 | LED 4 | LED 3 | LED 2 | LED 1 | LED 0 | Apenas / PIC | Key 7 | Key 6 | Key 5 | Key 4 | Key 3 | Key 2 | Key 1 | Key 0